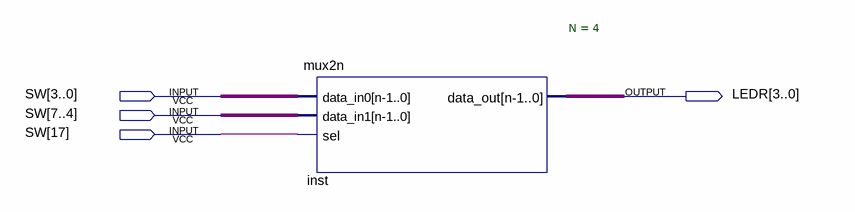
[diagram p0: schematic sheet]
// Quartus schematic test_mux2n.bdf as structural Verilog: 1 symbols, 4 pins
module test_mux2n (
  input  [17:0] SW,
  output [3:0] LEDR
);

  mux2n #(.N(4)) inst (.data_in0(SW[3:0]), .data_in1(SW[7:4]), .sel(SW[17]), .data_out(LEDR));
endmodule
